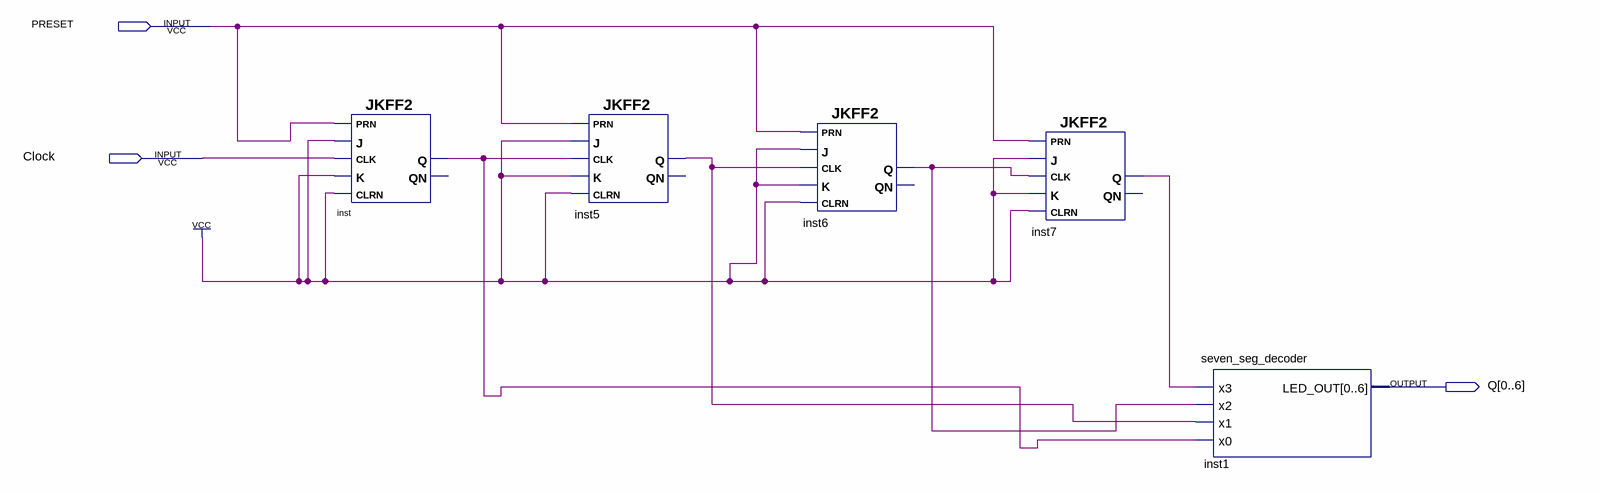
[diagram p0: schematic sheet]
// Quartus schematic lab10step3a.bdf as structural Verilog: 5 symbols, 3 pins
module lab10step3a (
  input  PRESET,
  input  Clock,
  output [0:6] Q
);

  wire inst5_q, inst6_q, inst7_q, inst_q;

  JKFF2 inst (.K(1'b1), .CLRN(1'b1), .CLK(Clock), .PRN(PRESET), .J(1'b1), .Q(inst_q));  // open: QN
  JKFF2 inst5 (.K(1'b1), .CLRN(1'b1), .CLK(inst_q), .PRN(PRESET), .J(1'b1), .Q(inst5_q));  // open: QN
  JKFF2 inst6 (.K(1'b1), .CLRN(1'b1), .CLK(inst5_q), .PRN(PRESET), .J(1'b1), .Q(inst6_q));  // open: QN
  JKFF2 inst7 (.K(1'b1), .CLRN(1'b1), .CLK(inst6_q), .PRN(PRESET), .J(1'b1), .Q(inst7_q));  // open: QN
  seven_seg_decoder inst1 (.x3(inst7_q), .x2(inst6_q), .x1(inst5_q), .x0(inst_q), .LED_OUT(Q));
endmodule
